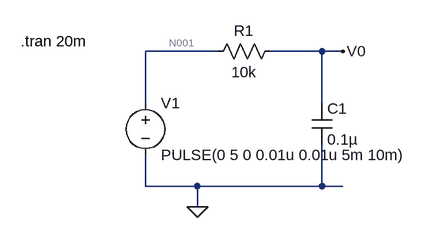
[diagram p0: schematic Draft1.asc]
Draft1.asc, the LTspice schematic file:
Version 4
SHEET 1 880 680
WIRE 192 64 80 64
WIRE 352 64 272 64
WIRE 384 64 352 64
WIRE 80 144 80 64
WIRE 352 144 352 64
WIRE 80 272 80 224
WIRE 160 272 80 272
WIRE 352 272 352 208
WIRE 352 272 160 272
WIRE 384 272 352 272
WIRE 160 304 160 272
FLAG 160 304 0
FLAG 384 64 V0
SYMBOL voltage 80 128 R0
WINDOW 123 0 0 Left 0
WINDOW 39 0 0 Left 0
SYMATTR InstName V1
SYMATTR Value PULSE(0 5 0 0.01u 0.01u 5m 10m)
SYMBOL cap 336 144 R0
SYMATTR InstName C1
SYMATTR Value 0.1µ
SYMBOL res 288 48 R90
WINDOW 0 0 56 VBottom 2
WINDOW 3 32 56 VTop 2
SYMATTR InstName R1
SYMATTR Value 10k
TEXT -112 48 Left 2 !.tran 20m

The netlist it stands for:
* Draft1.asc
V1 N001 0 PULSE(0 5 0 0.01u 0.01u 5m 10m)
C1 V0 0 0.1µ
R1 V0 N001 10k
.tran 20m
.backanno
.end

* Results of the author's LTspice run, read from the files saved beside the schematic
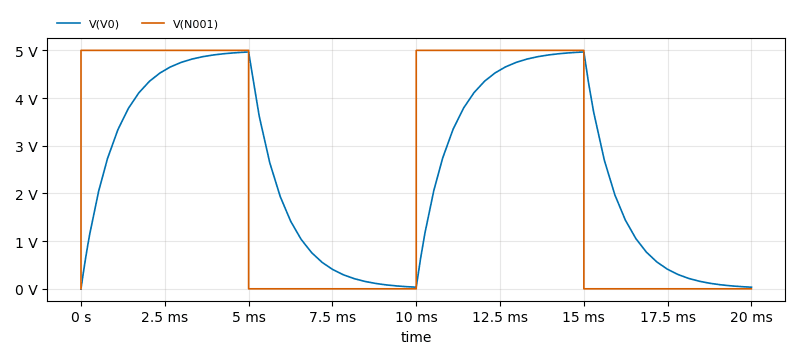
[diagram p1: Transient Analysis of Draft1.asc, plotted from the saved traces]
* Transient Analysis, 1 run:
*   V(V0): min 0 V, max 4.967 V, average 2.499 V, rms 3.17 V, last 33.46 mV
*   V(N001): min 0 V, max 5 V, average 2.5 V, rms 3.536 V, last 0 V